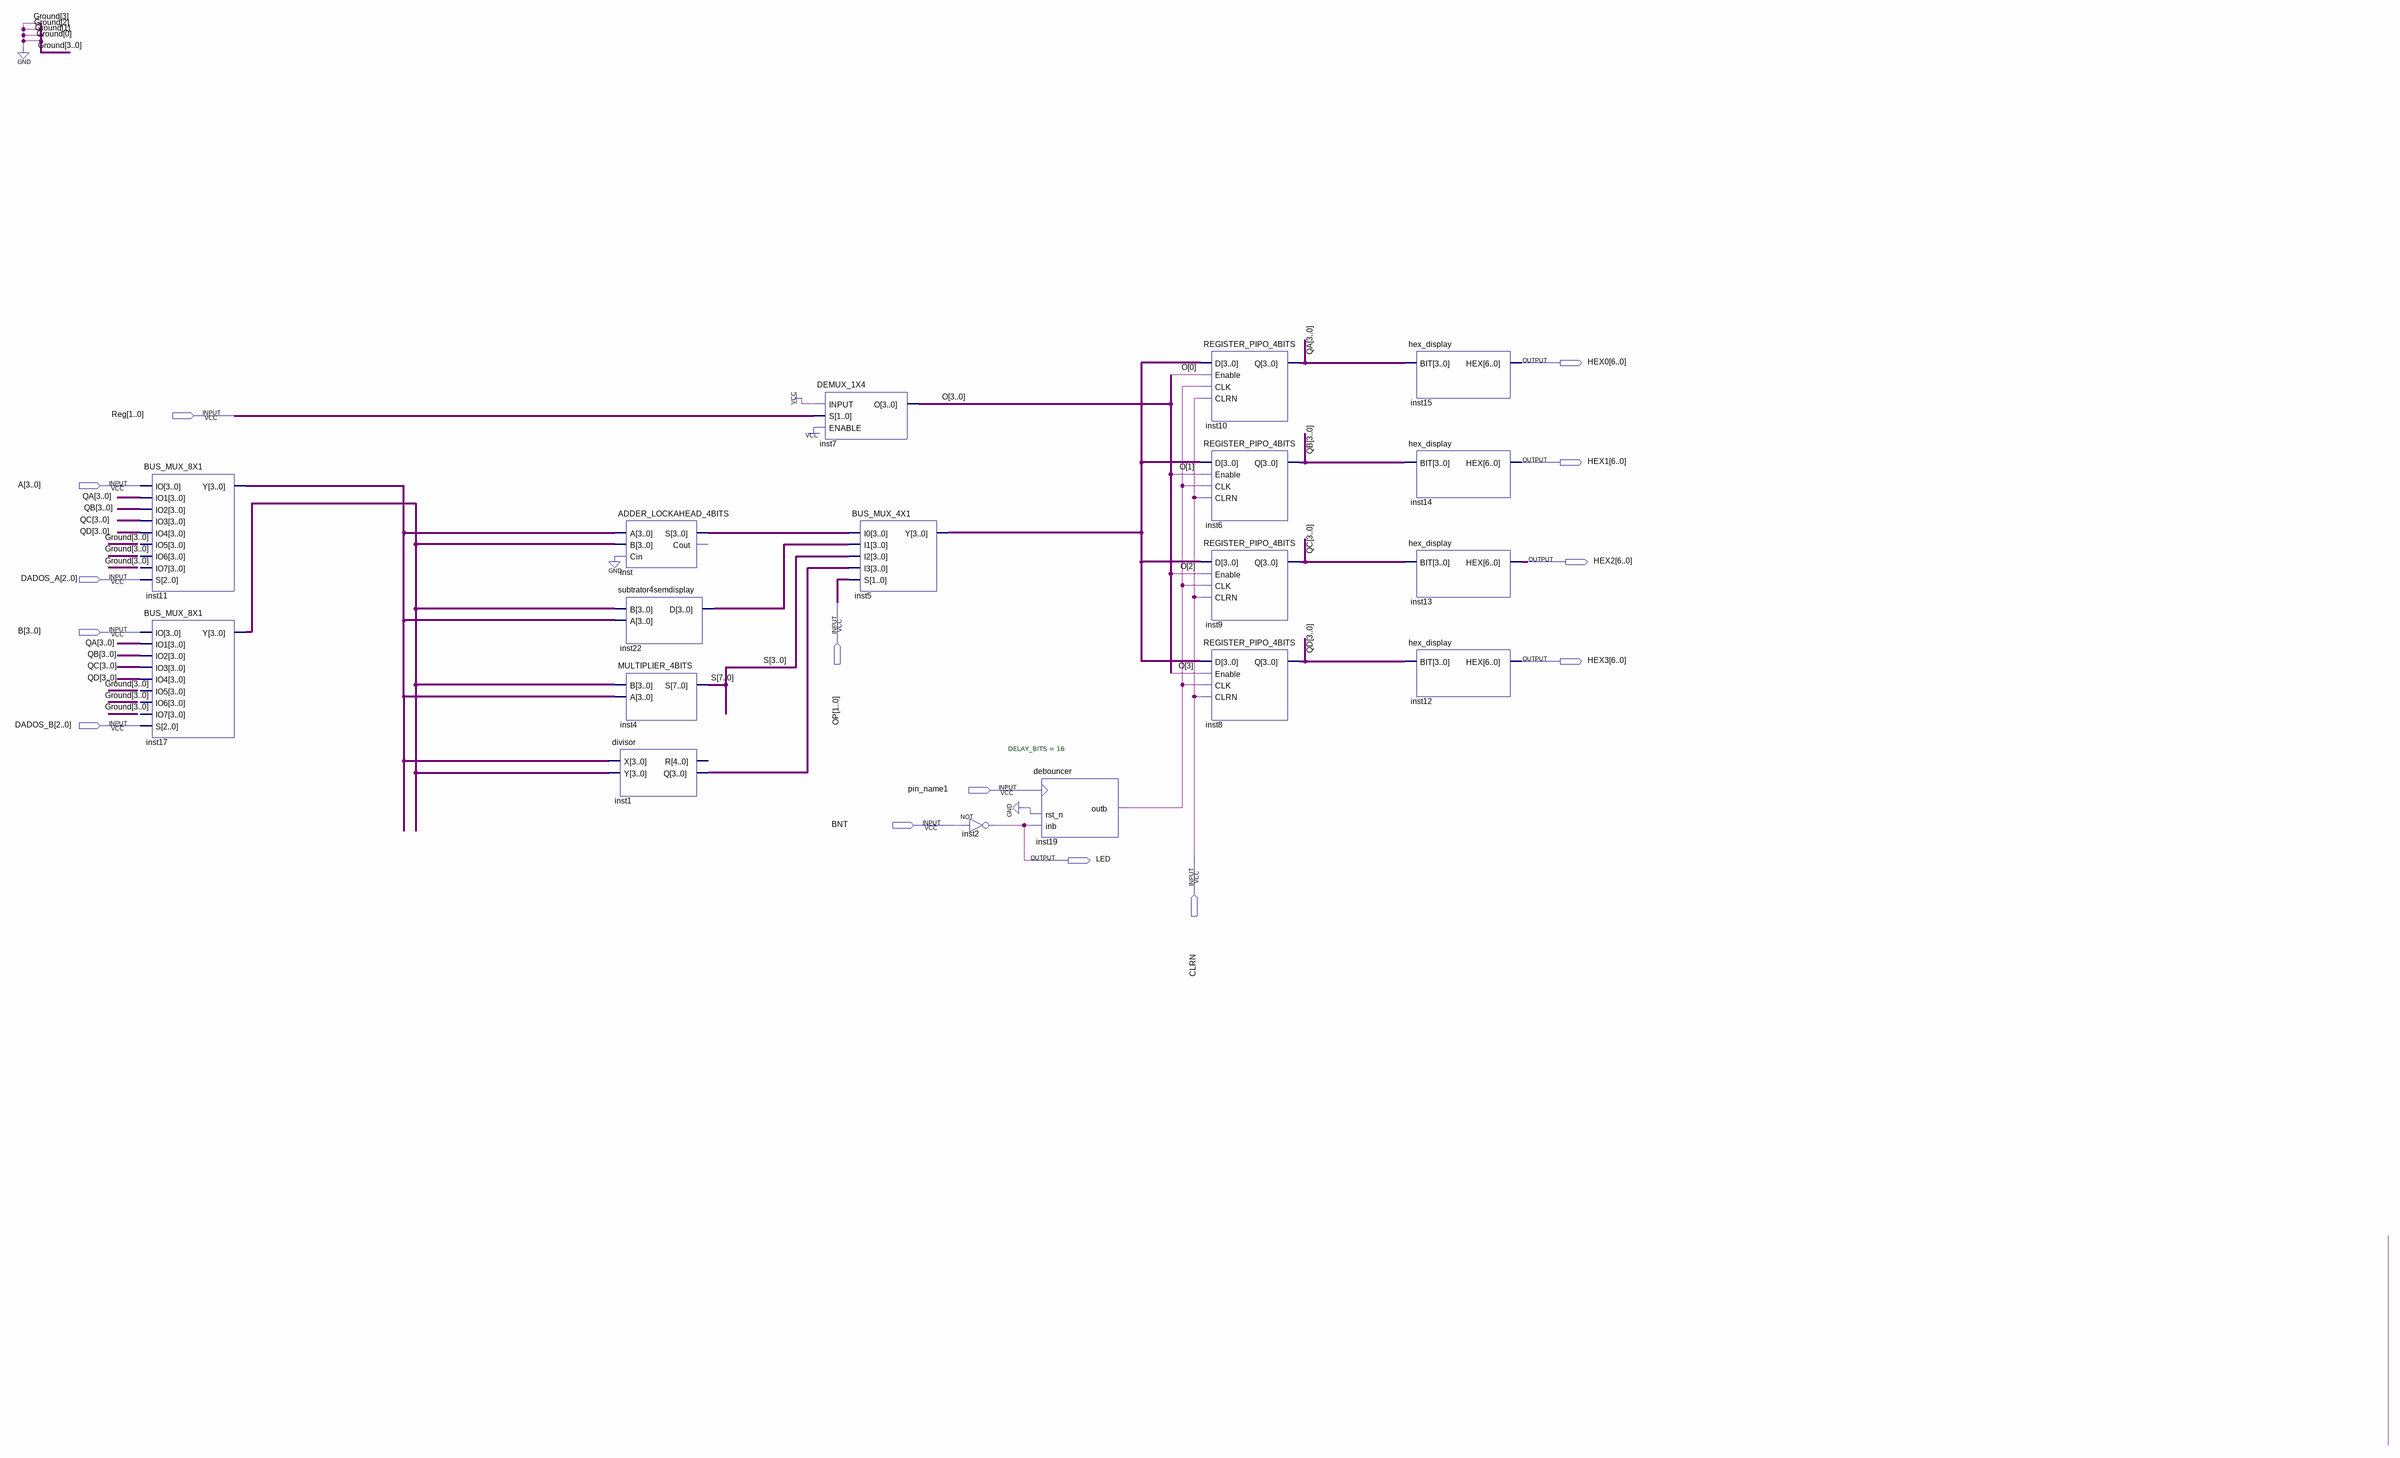
[diagram p0: schematic sheet]
// Quartus schematic projeto.bdf as structural Verilog: 18 symbols, 14 pins
module projeto (
  input  [1:0] Reg,
  input  [3:0] A,
  input  [2:0] DADOS_A,
  input  [1:0] OP,
  input  [3:0] B,
  input  [2:0] DADOS_B,
  input  pin_name1,
  input  BNT,
  input  CLRN,
  output [6:0] HEX0,
  output [6:0] HEX1,
  output [6:0] HEX2,
  output [6:0] HEX3,
  output LED
);

  wire inst19_outb;
  wire [3:0] inst1_q, inst5_y, inst11_y, inst17_y, inst22_d, inst_s, O, QA, QB, QC, QD;
  wire [7:0] S;

  BUS_MUX_8X1 inst11 (
    .IO(A), .IO1(QA), .IO2(QB), .IO3(QC), .IO4(QD), .S(DADOS_A), .Y(inst11_y));  // open: IO5, IO6, IO7
  BUS_MUX_8X1 inst17 (
    .IO(B), .IO1(QA), .IO2(QB), .IO3(QC), .IO4(QD), .S(DADOS_B), .Y(inst17_y));  // open: IO5, IO6, IO7
  ADDER_LOCKAHEAD_4BITS inst (.Cin(1'b0), .B(inst17_y), .A(inst11_y), .S(inst_s));  // open: Cout
  subtrator4semdisplay inst22 (.B(inst17_y), .A(inst11_y), .D(inst22_d));
  MULTIPLIER_4BITS inst4 (.B(inst17_y), .A(inst11_y), .S(S));
  divisor inst1 (.X(inst11_y), .Y(inst17_y), .Q(inst1_q));  // open: R
  DEMUX_1X4 inst7 (.INPUT(1'b1), .S(Reg), .ENABLE(1'b1), .O(O));
  BUS_MUX_4X1 inst5 (.I0(inst_s), .I1(inst22_d), .I2(S[3:0]), .I3(inst1_q), .S(OP), .Y(inst5_y));
  not inst2 (LED, BNT);
  debouncer #(.DELAY_BITS(16)) inst19 (.clk(pin_name1), .inb(LED), .rst_n(1'b0), .outb(inst19_outb));
  REGISTER_PIPO_4BITS inst10 (.D(inst5_y), .Enable(O[0]), .CLK(inst19_outb), .CLRN(CLRN), .Q(QA));
  REGISTER_PIPO_4BITS inst6 (.D(inst5_y), .Enable(O[1]), .CLK(inst19_outb), .CLRN(CLRN), .Q(QB));
  REGISTER_PIPO_4BITS inst9 (.D(inst5_y), .Enable(O[2]), .CLK(inst19_outb), .CLRN(CLRN), .Q(QC));
  REGISTER_PIPO_4BITS inst8 (.D(inst5_y), .Enable(O[3]), .CLK(inst19_outb), .CLRN(CLRN), .Q(QD));
  hex_display inst15 (.BIT(QA), .HEX(HEX0));
  hex_display inst14 (.BIT(QB), .HEX(HEX1));
  hex_display inst13 (.BIT(QC), .HEX(HEX2));
  hex_display inst12 (.BIT(QD), .HEX(HEX3));
endmodule
